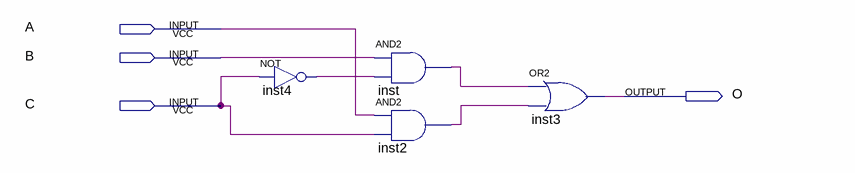
[diagram p0: schematic sheet]
// Quartus schematic lucas.bdf as structural Verilog: 4 symbols, 4 pins
module lucas (
  input  A,
  input  B,
  input  C,
  output O
);

  wire inst2_out, inst4_out, inst_out;

  not inst4 (inst4_out, C);
  and inst (inst_out, B, inst4_out);
  and inst2 (inst2_out, A, C);
  or inst3 (O, inst_out, inst2_out);
endmodule
